# EAGLE design power_decoupling (EAGLE 7.7.0)
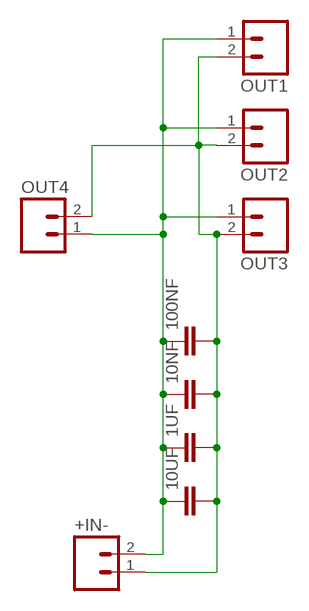
[diagram p0: schematic, sheet 1]

## Parts
1UF  CAP0805  [0805]
10NF  CAP0805  [0805]
10UF  CAP0805  [0805]
100NF  CAP0805  [0805]
+IN-  M02PTH  [1X02]
OUT1  M02PTH  [1X02]
OUT2  M02PTH  [1X02]
OUT3  M02PTH  [1X02]
OUT4  M02PTH  [1X02]

## Nets
GND: 1UF.2 10NF.2 10UF.2 100NF.2 +IN-.1 OUT1.2 OUT2.2 OUT3.2 OUT4.2
VCC: 1UF.1 10NF.1 10UF.1 100NF.1 +IN-.2 OUT1.1 OUT2.1 OUT3.1 OUT4.1

## Library data of the parts
1UF 10NF 10UF 100NF = SparkFun-Passives:CAP: Capacitor Standard 0603 ceramic capacitor, and 0.1" leaded capacitor.
+IN- OUT1-OUT4 = SparkFun-Connectors:M02: Standard 2-pin 0.1" header. Use with - straight break away headers ( PRT-00116) - right angle break away headers (PRT-00553) - swiss pins (PRT-00743) - machine pins (PRT-00117) - female headers (PRT-00115) Molex polarized connector foot print use with: PRT-08233 with associated crimp pins and housings. 2.54_SCREWTERM for use with PRT-10571. 3.5mm Screw Terminal footprints for PRT-08084 5mm Screw Terminal footprints for use with PRT-08432

## Board
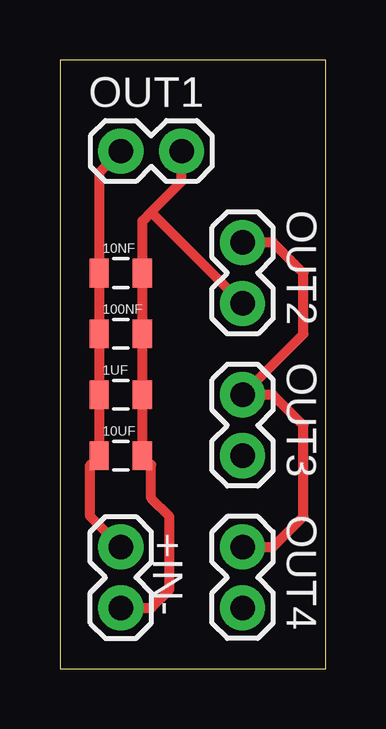
[diagram p1: board, top side]
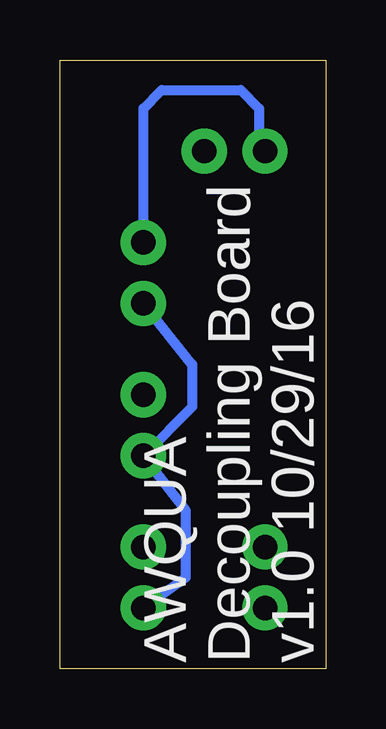
[diagram p2: board, bottom side, seen from below]

Size 11.1 x 25.39 mm. Coordinates in mm from the lower left corner, seen from the top.
Outline: 0,0 11.1,0 11.1,25.39 0,25.39 0,0
Copper layers (1*16): Top 0.035mm / dielectric 1.5mm / Bottom 0.035mm
Design rules "default": minimum track width 10mil, minimum drill 24mil, track to track 8mil, track to pad 8mil, pad to pad 8mil, via to via 8mil, smd to smd 8mil, copper to edge 40mil, drill to drill 8mil, minimum pad ring 10mil, minimum via ring 8mil, stop-mask expansion 4mil, vias tented up to drill 0mil, thermal gap 10mil

### Footprints (pad centres in the part's own frame; a part is rotated, then mirrored left to right if it is on the bottom)
0805 = smd 0.8 x 1.2: 1 -0.9,0; 2 0.9,0
1X02 = drill 1.016 pad 1.88: 1 0,0; 2 2.54,0

### Placement (x,y rotation side)
1UF  2.54,11.43 0 top
10NF  2.54,16.51 0 top
10UF  2.54,8.89 0 top
100NF  2.54,13.97 0 top
+IN-  2.54,2.54 90 top
OUT1  2.54,21.59 0 top
OUT2  7.62,17.78 270 top
OUT3  7.62,11.43 270 top
OUT4  7.62,5.08 270 top

### Tracks (layer width: path | path; a pad name or v marks a point on that pad's centre or on a via)
GND
  Top 0.406: 3.81,19.05 3.44,18.68 10NF.2 100NF.2 1UF.2 10UF.2 3.44,8.52 3.81,8.52 3.81,7.11 4.57,6.35 4.57,3.3 3.81,2.54 +IN-.1 | 3.81,19.05 5.08,20.32 OUT1.2 | OUT2.2 3.81,19.05
  Bottom 0.406: OUT2.2 5.59,12.7 5.59,10.92 OUT3.2 5.84,6.6 5.84,3.81 OUT4.2
VCC
  Top 0.406: OUT1.1 1.64,20.69 10NF.1 100NF.1 1UF.1 10UF.1 1.64,8.52 1.27,8.52 1.27,6.35 +IN-.2 | OUT2.1 8.89,17.78 10.16,16.51 10.16,13.97 OUT3.1 8.89,11.43 10.16,10.16 10.16,6.35 8.89,5.08 OUT4.1
  Bottom 0.406: OUT2.1 7.62,23.37 6.86,24.13 3.56,24.13 2.79,23.37 2.79,21.84 OUT1.1

### Text on the board
bNames: AWQUA / Decoupling Board / v1.0 10/29/16